# Altium schematic sheet Switches.SchDoc: RespiraWorks
size A3; CompanyName: RespiraWorks; DrawnBy: E. Chiu; Organization: Altium; DocumentNumber: 8; Revision: A1; SheetNumber: 8; SheetTotal: 8; PageSetup: Record=PageOptions|CenterHorizontal=True|CenterVertical=True|PrintScale=0.67|XCorrection=1.00|YCorrection=1.00|PrintKind=0|BorderSize=5000000|LeftOffset=0|BottomOffset=0|Orientation=2|PaperLength=1000|PaperWidth=1000|Scale=100|PaperSource=276|PrintQuality=-3|MediaType=1|DitherType=10|PrintScaleMode=1|PaperKind=11"x17" 279.4x431.8mm|PaperIndex=3; ProjectName: FALCON 3S
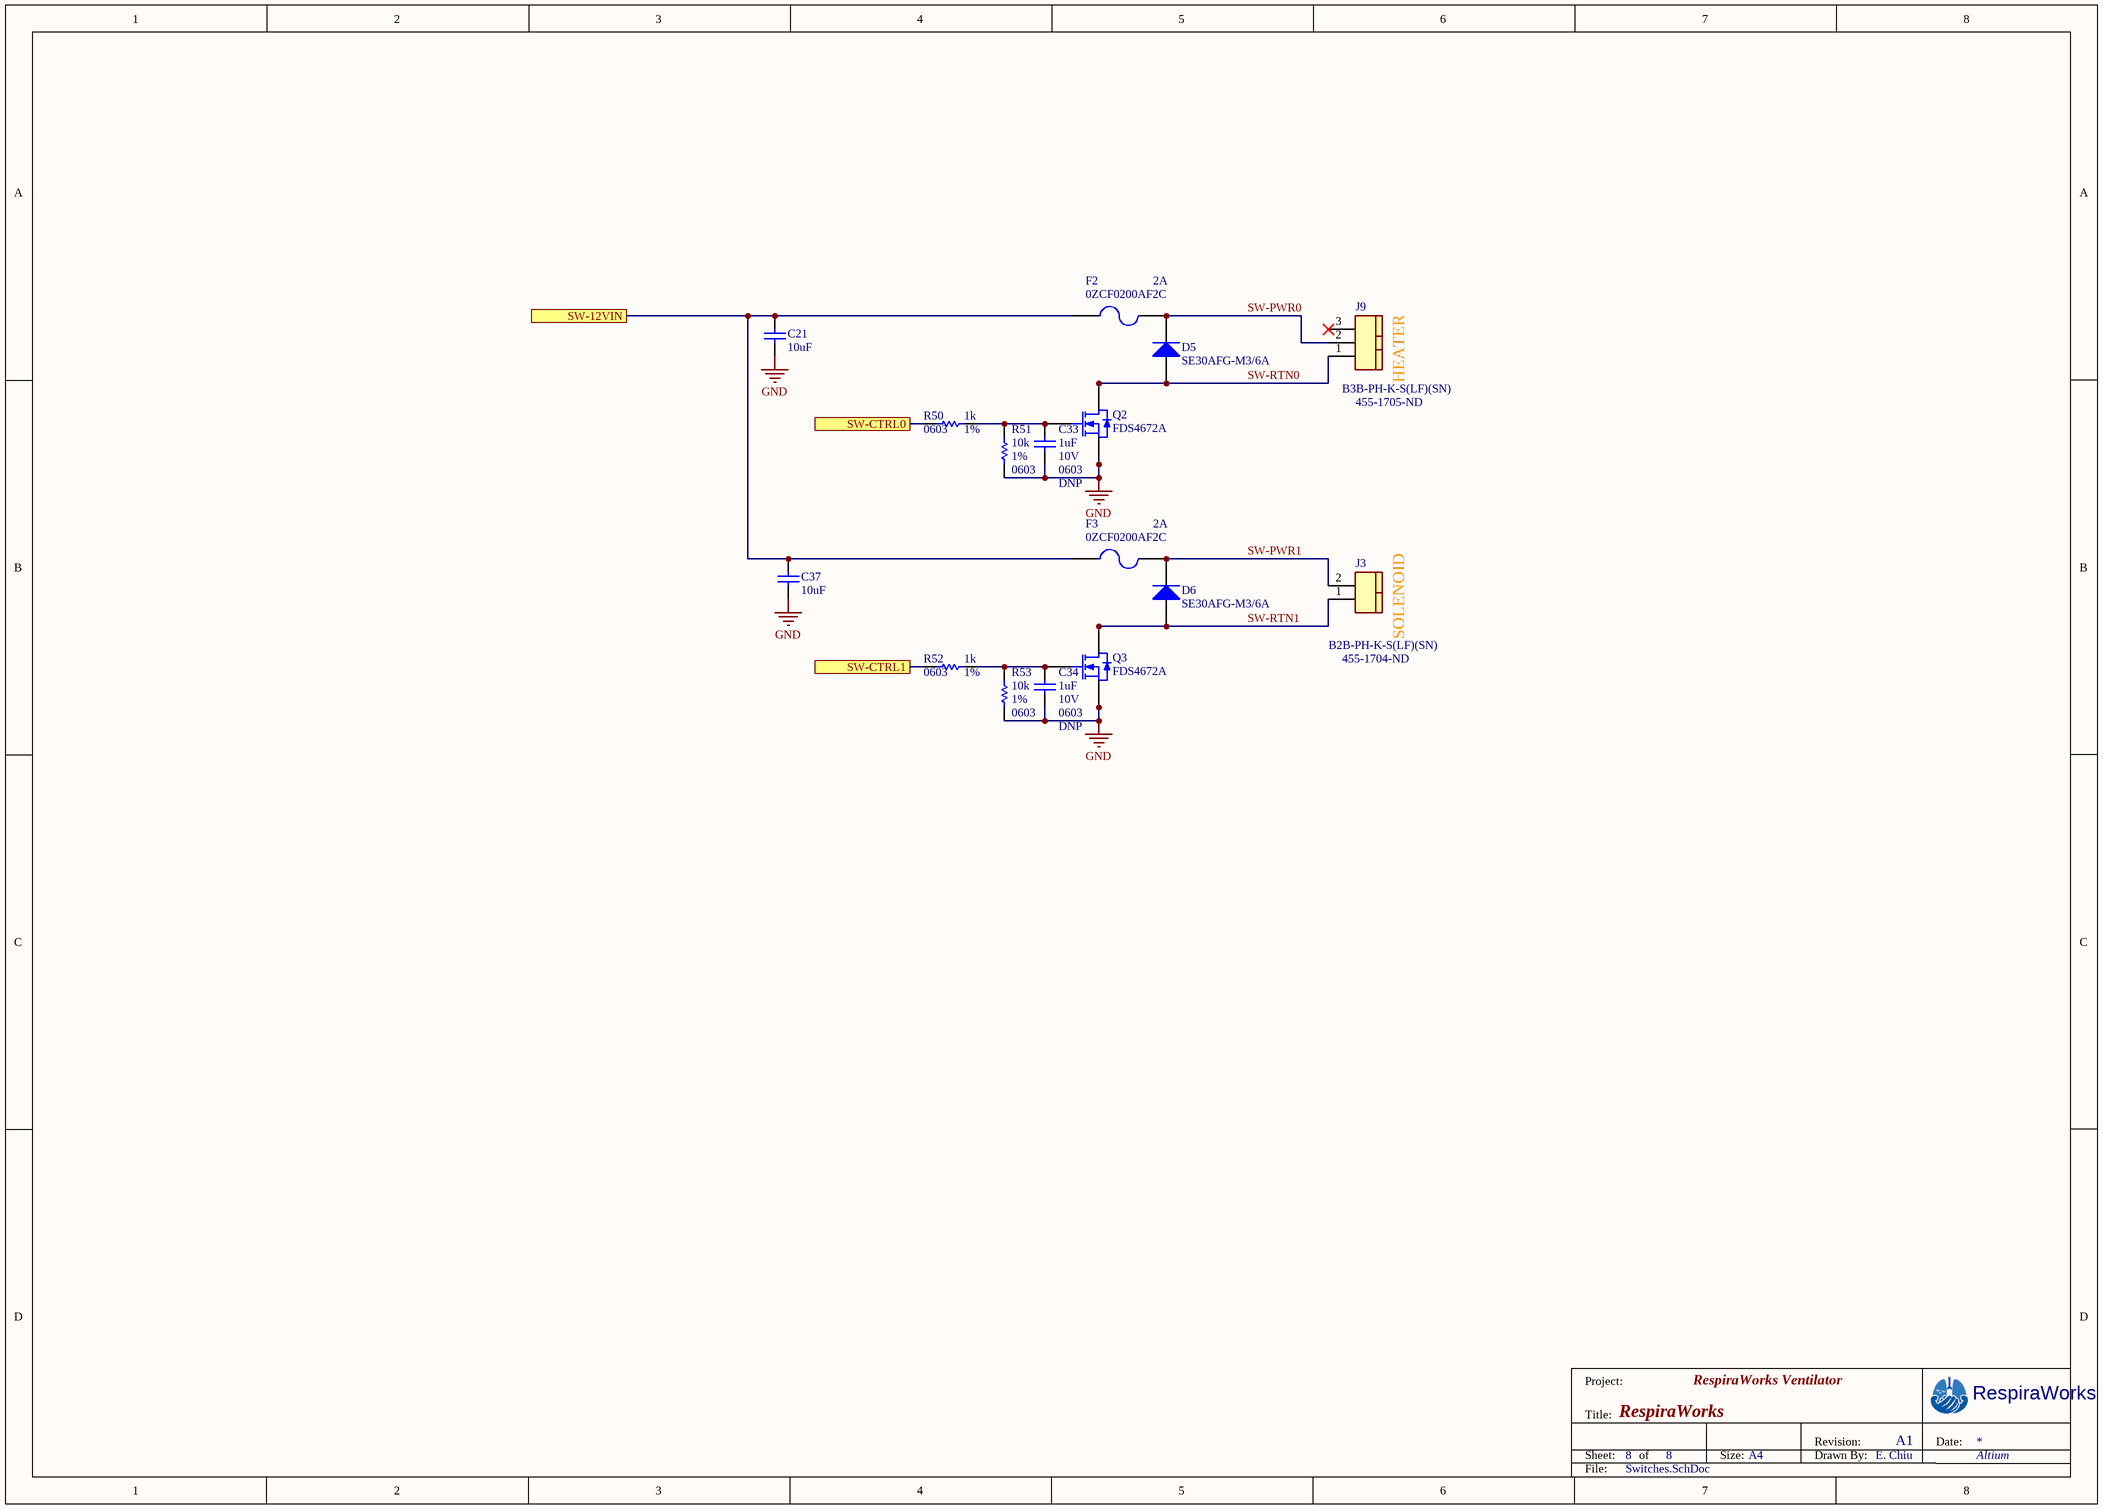
[diagram p0: Switches.SchDoc]

## Parts
C21  value 10uF  [CAP1210]  (hidden comment: CAP 1210)
C33  value 1uF  Voltage: 10V  PCB Package: 0603  Do Not Populate: DNP  [CAP0603]  (hidden comment: CAP 0603)
C34  value 1uF  Voltage: 10V  PCB Package: 0603  Do Not Populate: DNP  [CAP0603]  (hidden comment: CAP 0603)
C37  value 10uF  [CAP1210]  (hidden comment: CAP 1210)
D5  SE30AFG-M3/6A  [DO-214AC]
D6  SE30AFG-M3/6A  [DO-214AC]
F2  I(hold): 2A  [FUSE2920]  (hidden comment: 0ZCF0200AF2C)
F3  I(hold): 2A  [FUSE2920]  (hidden comment: 0ZCF0200AF2C)
J3  B2B-PH-K-S(LF)(SN)  Supplier Part Number 1: 455-1704-ND  [JST_B2B-XH-AM]
J9  B3B-PH-K-S(LF)(SN)  Supplier Part Number 1: 455-1705-ND  [JST_B3B-XH-AM]
Q2  FDS4672A  [8-SOIC]
Q3  FDS4672A  [8-SOIC]
R50  value 1k  PCB Package: 0603  Tolerance: 1%  [RES0603]  (hidden comment: RES 0603)
R51  value 10k  PCB Package: 0603  Tolerance: 1%  [RES0603]  (hidden comment: RES 0603)
R52  value 1k  PCB Package: 0603  Tolerance: 1%  [RES0603]  (hidden comment: RES 0603)
R53  value 10k  PCB Package: 0603  Tolerance: 1%  [RES0603]  (hidden comment: RES 0603)

## Ports
SW-12VIN, SW-CTRL0, SW-CTRL1

## Nets
GND: C21.1 C33.2 C34.2 C37.1 Q2.1(S) Q2.2(S) Q2.3(S) Q3.1(S) Q3.2(S) Q3.3(S) R51.2 R53.2
SW-12VIN: C21.2 C37.2 F2.1 F3.1 ; port SW-12VIN
SW-CTRL0: R50.2 ; port SW-CTRL0
SW-CTRL1: R52.2 ; port SW-CTRL1
SW-PWR0: D5.K F2.2 J9.2
SW-PWR1: D6.K F3.2 J3.2
SW-RTN0: D5.A J9.1 Q2.5(D) Q2.6(D) Q2.7(D) Q2.8(D)
SW-RTN1: D6.A J3.1 Q3.5(D) Q3.6(D) Q3.7(D) Q3.8(D)
NetC33_1: C33.1 Q2.4(G) R50.1 R51.1
NetC34_1: C34.1 Q3.4(G) R52.1 R53.1

Not connected (* = marked no-connect by the designer): J9 3*

## Notes on the sheet
- (near J9) HEATER
- (near J3) SOLENOID
- Project:
- RespiraWorks Ventilator
- Title:
- Sheet:
- of
- Size:
- A4
- Drawn By:
- Revision:
- Date:
- File:

## Library data of the parts
C21 C37 = CAP 1210: Manufacturer P/N: GRM32DR71E106KA12L; Manufacturer: Murata; Voltage: 25V; PCB Package: 1210; Type: X7R; Do Not Populate: *
C33 C34 = CAP 0603: Manufacturer P/N: CC0603KRX7R6BB105; Manufacturer: Yageo; Type: X7R
D5 D6 = SE30AFG-M3/6A: Ultra-Fast Signal Diode, Silicon, 100V, 300mA; Manufacturer: Vishay; Type: GP Standard Recovery; Reverse Voltage: 400V; I(max): 3A; PCB Package: DO-221AC, SMA Flat Leads; Do Not Populate: *; Manufacturer P/N: SE30AFG-M3/6A
F2 F3 = 0ZCF0200AF2C: PTC Fuse, 2A Hold, 24V, 2920 size; Manufacturer: Belfuse; I(trip): 4A; PCB Package: 2920; Manufacturer P/N: 0ZCF0200AF2C; Do Not Populate: *; V(max): 24V
J3 = B2B-PH-K-S(LF)(SN): CONN HEADER PH TOP 2POS 2MM; Manufacturer: JST Sales America Inc.; Connector Type: Header, Shrouded; Number of Positions: 2; Number of Positions Loaded: All; Pitch: 0.079" (2.00mm); Supplier 1: Digi-Key; Manufacturer Part Number: B2B-PH-K-S(LF)(SN); RoHS: RoHS Compliant; Category: Connectors, Interconnects; Stock 1: 207967; Pricing 1: 1=0.17, 10=0.162, 100=0.1002, 500=0.08288, 1000=0.07252, 5000=0.06216, 10000=0.06044 (USD); Packaging: Bulk; Part Status: Active; Contact Type: Male Pin; Number of Rows: 1; Row Spacing: -; Contact Mating Length: 0.130" (3.30mm); Mounting Type: Through Hole; Termination: Press-Fit, Solder; Fastening Type: Detent Lock; Features: -; Contact Finish: Tin; Contact Finish Thickness: -; Color: Natural; ComponentLink1URL: http://www.jst-mfg.com/product/pdf/eng/ePH.pdf; ComponentLink1Description: http://www.jst-mfg.com/product/pdf/eng/ePH.pdf; Manufacturer P/N: B2B-PH-K-S(LF)(SN)
J9 = B3B-PH-K-S(LF)(SN): CONN HEADER PH TOP 3POS 2MM; Manufacturer: JST Sales America Inc.; Connector Type: Header, Shrouded; Number of Positions: 3; Number of Positions Loaded: All; Pitch: 0.079" (2.00mm); Supplier 1: Digi-Key; Manufacturer Part Number: B3B-PH-K-S(LF)(SN); RoHS: RoHS Compliant; Category: Connectors, Interconnects; Stock 1: 55340; Pricing 1: 1=0.19, 10=0.182, 100=0.1262, 500=0.10676, 1000=0.08736, 5000=0.07765, 10000=0.07037 (USD); Packaging: Bulk; Part Status: Active; Contact Type: Male Pin; Number of Rows: 1; Row Spacing: -; Contact Mating Length: 0.130" (3.30mm); Mounting Type: Through Hole; Termination: Press-Fit, Solder; Fastening Type: Detent Lock; Features: -; Contact Finish: Tin; Contact Finish Thickness: -; Color: Natural; ComponentLink1URL: http://www.jst-mfg.com/product/pdf/eng/ePH.pdf; ComponentLink1Description: http://www.jst-mfg.com/product/pdf/eng/ePH.pdf; Manufacturer P/N: B3B-PH-K-S(LF)(SN)
Q2 Q3 = FDS4672A: Transistor, BJT NPN, General Purpose 40V; Manufacturer: On Semi; Vds(max): 60V; Ic(max): 11A; Rds_on: 13mohm; PCB Package: 8-SOIC; Manufacturer P/N: FDS4672A
R50 R52 = RES 0603: Manufacturer P/N: RC0603FR-071KL; Manufacturer: Yageo; Do Not Populate: *
R51 R53 = RES 0603: Manufacturer P/N: RC0603FR-0710KL; Manufacturer: Yageo; Do Not Populate: *